# EAGLE design Step_counter (EAGLE 9.6.2)
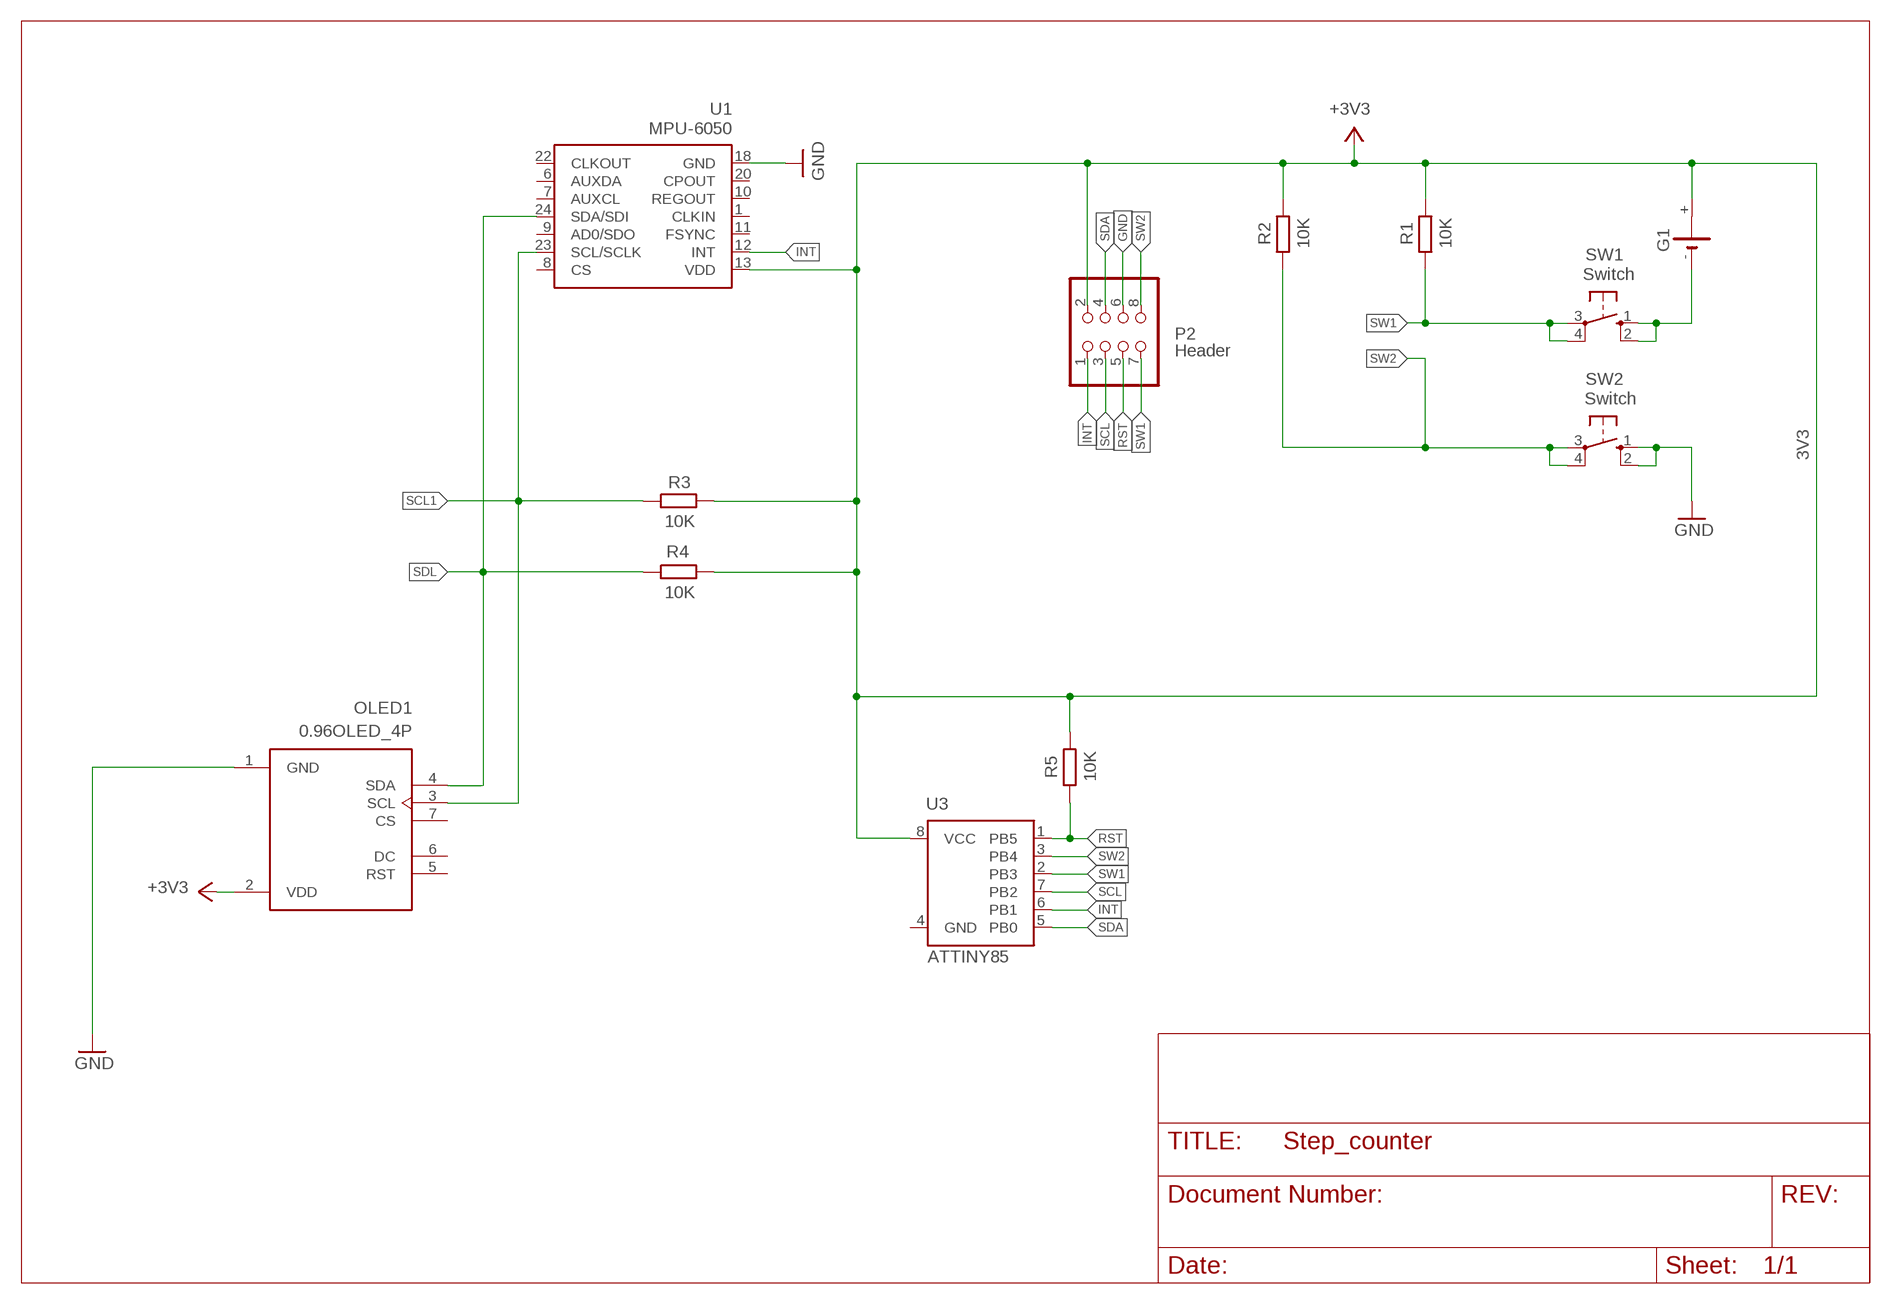
[diagram p0: schematic, sheet 1]

## Parts
G1  3V3  CR2032V  [CR2032V]
OLED1  0.96OLED_4P  AOM12864A0-1.54WW-ANO  [LCD_AOM12864A0-1.54WW-ANO]
P2  Header  PINHD-2X4  [2X04]
R1  10K  R-EU_0204/7  [0204/7]
R2  10K  R-EU_0204/7  [0204/7]
R3  10K  R-EU_0204/7  [0204/7]
R4  10K  R-EU_0204/7  [0204/7]
R5  10K  R-EU_0204/7  [0204/7]
SW1  Switch  10-XX  [B3F-10XX]
SW2  Switch  10-XX  [B3F-10XX]
U1  MPU-6050  MPU-6000  [QFN-24-EP]
U3  ATTINY85  [ATTINY85]

## Nets
+3V3: G1.+ OLED1.2(VDD) P2.2 R1.2 R2.2 R3.2 R4.2 R5.2 U1.13(VDD) U3.8(VCC)
GND: G1.- OLED1.1(GND) P2.6 SW1.1(S) SW1.2(S1) SW2.1(S) SW2.2(S1) U1.18(GND)
INT: P2.1 U1.12(INT) U3.6(PB1)
RST: P2.5 R5.1 U3.1(PB5)
SCL: P2.3 U3.7(PB2)
SCL1: OLED1.3(SCL) R3.1 U1.23(SCL/SCLK)
SDA: P2.4 U3.5(PB0)
SDL: OLED1.4(SDA) R4.1 U1.24(SDA/SDI)
SW1: P2.7 R1.1 SW1.3(P) SW1.4(P1) U3.2(PB3)
SW2: P2.8 R2.1 SW2.3(P) SW2.4(P1) U3.3(PB4)
Unconnected: G1.+@1(+) OLED1.5(RST) OLED1.6(DC) OLED1.7(CS) U1.1(CLKIN) U1.6(AUXDA) U1.7(AUXCL) U1.8(CS) U1.9(AD0/SDO) U1.10(REGOUT) U1.11(FSYNC) U1.20(CPOUT) U1.22(CLKOUT) U3.4(GND)

## Library data of the parts
G1 = battery:CR2032V: LI BATTERY Varta
OLED1 = AOM:AOM12864A0-1.54WW-ANO: Non-Touch Graphic LCD Display Module - White OLED SPI 1.54in (39.12mm) 128 x 64 Check availability <https://pricing.snapeda.com/parts/AOM12864A0-1.54WW-ANO/Orient%20Display/view-part?ref=eda>; AVAILABILITY: In Stock; DESCRIPTION: Non-Touch Graphic LCD Display Module - White OLED SPI 1.54 (39.12mm) 128 x 64; MF: Orient Display; MP: AOM12864A0-1.54WW-ANO; PACKAGE: None; PRICE: None; PURCHASE-URL: https://pricing.snapeda.com/search/part/AOM12864A0-1.54WW-ANO/?ref=eda
P2 = pinhead:PINHD-2X4: PIN HEADER
R1-R5 = rcl:R-EU_: RESISTOR, European symbol; SPICEPREFIX: R
SW1 SW2 = switch-omron:10-XX: OMRON SWITCH; MPN: B3F-1000; OC_FARNELL: 176432; OC_NEWARK: 36M3542
U1 = SparkFun-Sensors:MPU-6000: Invensense MPU-6000 6-Axis Gryoscope/Accelerometer 3-axis gyroscope, 3-axis accelerometer in a 4x4 package. The MPU-6000 is the world’s first 6-axis I²C MotionTracking device designed for the low power, low cost, and high performance requirements of smartphones, tablets and wearable sensors. Datasheet <http://cdn.sparkfun.com/datasheets/Components/General%20IC/PS-MPU-6000A.pdf> SparkFun Products MPU-6000 - Motion Processing Unit <https://www.sparkfun.com/products/11234> (SEN-11234) SparkFun UDB5 - PIC UAV Development Board <https://www.sparkfun.com/products/11703> (GPS-11703); PROD_ID: IC-11089; SF_ID: SEN-11234
U3 = SparkFun-IC-Microcontroller:ATTINY85; PROD_ID: IC-09092

## Board
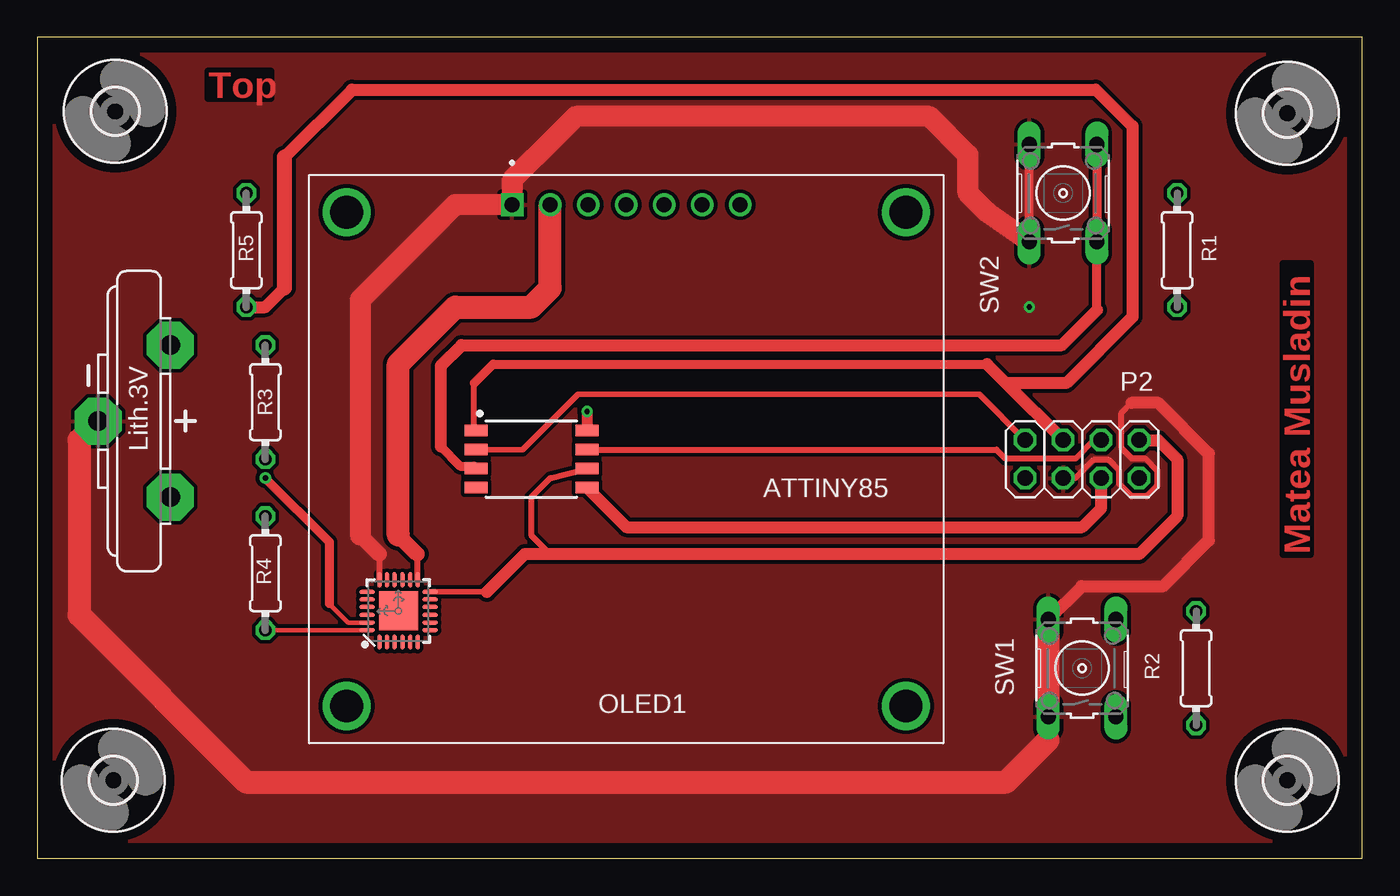
[diagram p1: board, top side]
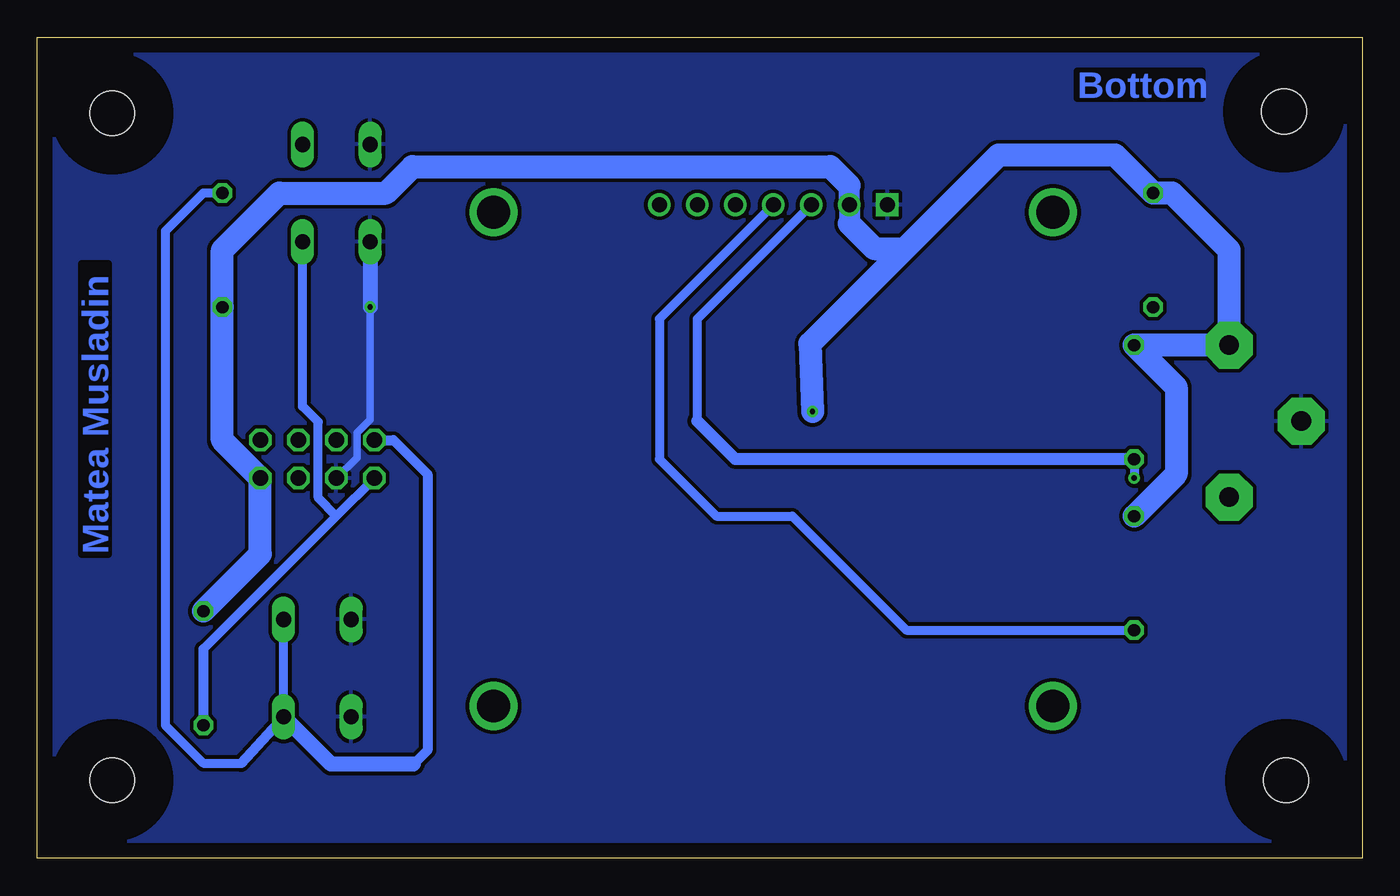
[diagram p2: board, bottom side, seen from below]

Size 88.57 x 54.85 mm. Coordinates in mm from the lower left corner, seen from the top.
Outline: 0,0 88.57,0 88.57,54.85 0,54.85 0,0
Copper layers (1*16): Top 0.035mm / dielectric 1.5mm / Bottom 0.035mm
Design rules "default *": minimum track width 6mil, minimum drill 0.35mm, track to track 10mil, track to pad 10mil, pad to pad 10mil, via to via 10mil, smd to smd 5mil, copper to edge 40mil, drill to drill 6mil, minimum pad ring 10mil, minimum via ring 8mil, stop-mask expansion 4mil, vias tented up to drill 0mil, thermal gap 10mil

### Footprints (pad centres in the part's own frame; a part is rotated, then mirrored left to right if it is on the bottom)
CR2032V = drill 1.321 pad 3.15 octagon: + -2.54,-5.08; +@1 -2.54,5.08; - 2.286,0
LCD_AOM12864A0-1.54WW-ANO = drill 1 square: 1 -7.62,17 | drill 1: 2 -5.08,17; 3 -2.54,17; 4 0,17; 5 2.54,17; 6 5.08,17; 7 7.62,17 | drill 2.2: P1 -18.7,16.5; P2 18.7,16.5; P3 -18.7,-16.5; P4 18.7,-16.5
2X04 = drill 1.016 octagon: 1 -3.81,-1.27; 2 -3.81,1.27; 3 -1.27,-1.27; 4 -1.27,1.27; 5 1.27,-1.27; 6 1.27,1.27; 7 3.81,-1.27; 8 3.81,1.27
0204/7 = drill 0.813 octagon: 1 -3.81,0; 2 3.81,0
B3F-10XX = drill 1.016 long: 1 -3.251,2.261; 2 3.251,2.261; 3 -3.251,-2.261; 4 3.251,-2.261
QFN-24-EP = smd 1.016 x 0.254: 1 -2.066,1.257; 2 -2.066,0.75; 3 -2.066,0.247; 4 -2.066,-0.287; 5 -2.066,-0.792; 6 -2.066,-1.297; 13 2.086,-1.297; 14 2.086,-0.792; 15 2.086,-0.287; 16 2.086,0.247; 17 2.086,0.75; 18 2.086,1.257 | smd 0.254 x 1.016: 7 -1.267,-2.122; 8 -0.762,-2.122; 9 -0.258,-2.122; 10 0.278,-2.122; 11 0.78,-2.122; 12 1.287,-2.122; 19 1.287,2.082; 20 0.78,2.082; 21 0.278,2.082; 22 -0.258,2.082; 23 -0.762,2.082; 24 -1.267,2.082 | smd 2.616 x 2.616: P$1 0.02,-0.01
ATTINY85 = smd 1.524 x 0.762: 1 -3.683,1.905; 2 -3.683,0.635; 3 -3.683,-0.635; 4 -3.683,-1.905; 5 3.727,-1.905; 6 3.727,-0.635; 7 3.727,0.635; 8 3.727,1.905
3,0 = hole 3: 0,0

### Placement (x,y rotation side)
G1  6.35,29.21 180 top
OLED1  39.37,26.67 0 top
P2  69.85,26.67 180 top
R1  76.2,40.64 270 top
R2  77.47,12.7 90 top
R3  15.24,30.48 90 top
R4  15.24,19.05 90 top
R5  13.97,40.64 90 top
SW1  69.85,12.7 90 top
SW2  68.58,44.45 90 top
U1  24.13,16.51 90 top
U3  33.02,26.67 0 top
U$1  [3,0]  5.08,5.21 0 top
U$2  [3,0]  5.21,49.91 0 top
U$3  [3,0]  83.57,5.21 0 top
U$4  [3,0]  83.57,49.78 0 top

### Tracks (layer width: path | path; a pad name or v marks a point on that pad's centre or on a via)
+3V3  (via drill 0.35)
  Top 0.406: U1.13 25.41,18.62 25.41,19.18 25.4,19.18 25.4,20.32
  Top 0.737: v36.75,29.84 U3.8
  Top 1.016: 25.4,20.32 24.13,21.59
  Top 1.524: 24.13,21.59 24.13,33.02 27.94,36.83 33.02,36.83 34.29,38.1 OLED1.2
  Bottom 1.397: 34.29,44.94 OLED1.2 34.29,42.4
  Bottom 1.524: 34.29,44.94 35.56,46.21 63.5,46.21 65.26,44.45 72.39,44.45 76.2,40.64 R1.2 76.2,27.94 P2.2 73.66,20.32 R2.2 | R4.2 12.43,25.67 12.43,31.48 R3.2 G1.+ 8.89,40.64 12.7,44.45 R5.2 16.51,46.99 24.31,46.99 30.57,40.73 | 30.57,40.73 36.92,34.38 v36.75,29.84 | 34.29,42.4 32.62,40.73 30.57,40.73
GND  (via drill 0.35)
  Top 0.406: 22.86,20.32 U1.18 | 73.16,30.43 72.44,29.71 72.44,27.43 73.16,26.72 74.06,26.72 74.88,25.91 74.88,24.89 74.17,24.18 73.16,24.18 72.34,25 72.34,25.91 71.62,26.62 70.61,26.62 69.4,25.4 P2.6
  Top 0.61: SW2.1 SW2.2
  Top 0.762: 34.73,48.31 34.78,48.26
  Top 0.813: SW1.2 69.83,18.19 75.29,18.19 78.33,21.23 78.33,27.03 74.93,30.43 73.16,30.43
  Top 1.016: 21.59,21.59 22.86,20.32
  Top 1.27: 67.59,7.9 SW1.1
  Top 1.397: 21.59,21.59 21.59,37.32 27.94,43.67 OLED1.1 31.75,45.33 34.73,48.31 36,49.58 59.64,49.58 62.23,46.99 62.23,44.45 63.5,43.18 SW2.1
  Top 1.524: G1.- 2.79,27.94 2.79,16.26 13.97,5.08 64.77,5.08 67.59,7.9 | SW1.1 SW1.2
  Bottom 0.508: v66.32,36.83 66.32,29.31 67.21,28.42 67.21,26.77 P2.6
  Bottom 1.016: SW2.1 v66.32,36.83
  pour Top: 0,0 0,54.61 88.9,54.61 88.9,0
  pour Bottom: 0,0 0,54.61 1.27,54.61 88.9,54.61 88.9,0
INT
  Top 0.381: U1.12 30.06,17.8
  Top 0.406: U3.6 34.29,25.4 33.02,24.13 33.02,21.59 34.29,20.32
  Top 0.813: 30.06,17.8 32.59,20.32 34.29,20.32 73.66,20.32 76.2,22.86 76.2,26.67 74.93,27.94 P2.1
RST
  Top 0.406: U3.1 29.21,28.57 29.21,31.75
  Top 0.61: 63.5,33.02 30.48,33.02 29.21,31.75
  Top 0.813: P2.5 64.77,31.75 | 64.77,31.75 63.5,33.02 | 16.51,38.1 15.24,36.83 R5.1 | 16.51,46.85 21.03,51.37 70.77,51.37 73.22,48.92 73.22,36.17 68.8,31.75 64.77,31.75
  Top 1.016: 16.51,46.85 16.51,38.1
SCL
  Top 0.381: P2.3 70.65,27.94
  Top 0.406: 70.65,27.94 69.42,26.71 64.73,26.71 64.14,27.3 U3.7
SCL1  (via drill 0.35)
  Top 0.305: U1.23 20.78,15.75 19.51,17.02
  Top 0.61: v15.24,25.4 19.51,21.13 19.51,17.02
  Bottom 0.61: R3.1 v15.24,25.4 | OLED1.3 44.45,36.05 44.45,29.21
  Bottom 0.813: R3.1 41.91,26.67 44.45,29.21
SDA
  Top 0.813: U3.5 39.39,22.12 69.85,22.12 71.12,23.39 P2.4
SDL
  Top 0.305: U1.24 R4.1
  Bottom 0.61: OLED1.4 46.99,36.05 46.99,26.67 43.18,22.86 38.1,22.86 30.48,15.24 R4.1
SW1
  Top 0.381: U3.2 32.42,27.3 36.13,31.01 62.97,31.01 P2.7
  Bottom 0.381: 63.43,6.28 63.54,6.16
  Bottom 0.61: R1.1 77.47,44.45 80.01,41.91 80.01,8.89 77.47,6.35 74.93,6.35 | SW1.3 SW1.4
  Bottom 0.66: P2.7 64.77,27.94 62.5,25.67 62.5,7.2 63.43,6.28 | 74.93,6.35 SW1.3
  Bottom 1.016: 63.43,6.28 68.94,6.28 SW1.3
SW2
  Top 0.61: 70.84,36.63 SW2.3 SW2.4 | U3.3 29.17,26.2 28.27,26.2 26.96,27.51
  Top 0.813: 26.96,27.51 26.96,32.91 28.35,34.29 68.51,34.29 70.84,36.63
  Bottom 0.61: P2.8 68.58,22.86 | 68.58,22.86 77.47,13.97 | SW2.3 70.84,30.2 69.8,29.16 69.8,24.08 68.58,22.86
  Bottom 0.66: 77.47,13.97 R2.1

### Text on the board
Top: Top | Matea Musladin
Bottom: Bottom | Matea Musladin